# EAGLE design RFIDAccess (EAGLE 9.1.3)
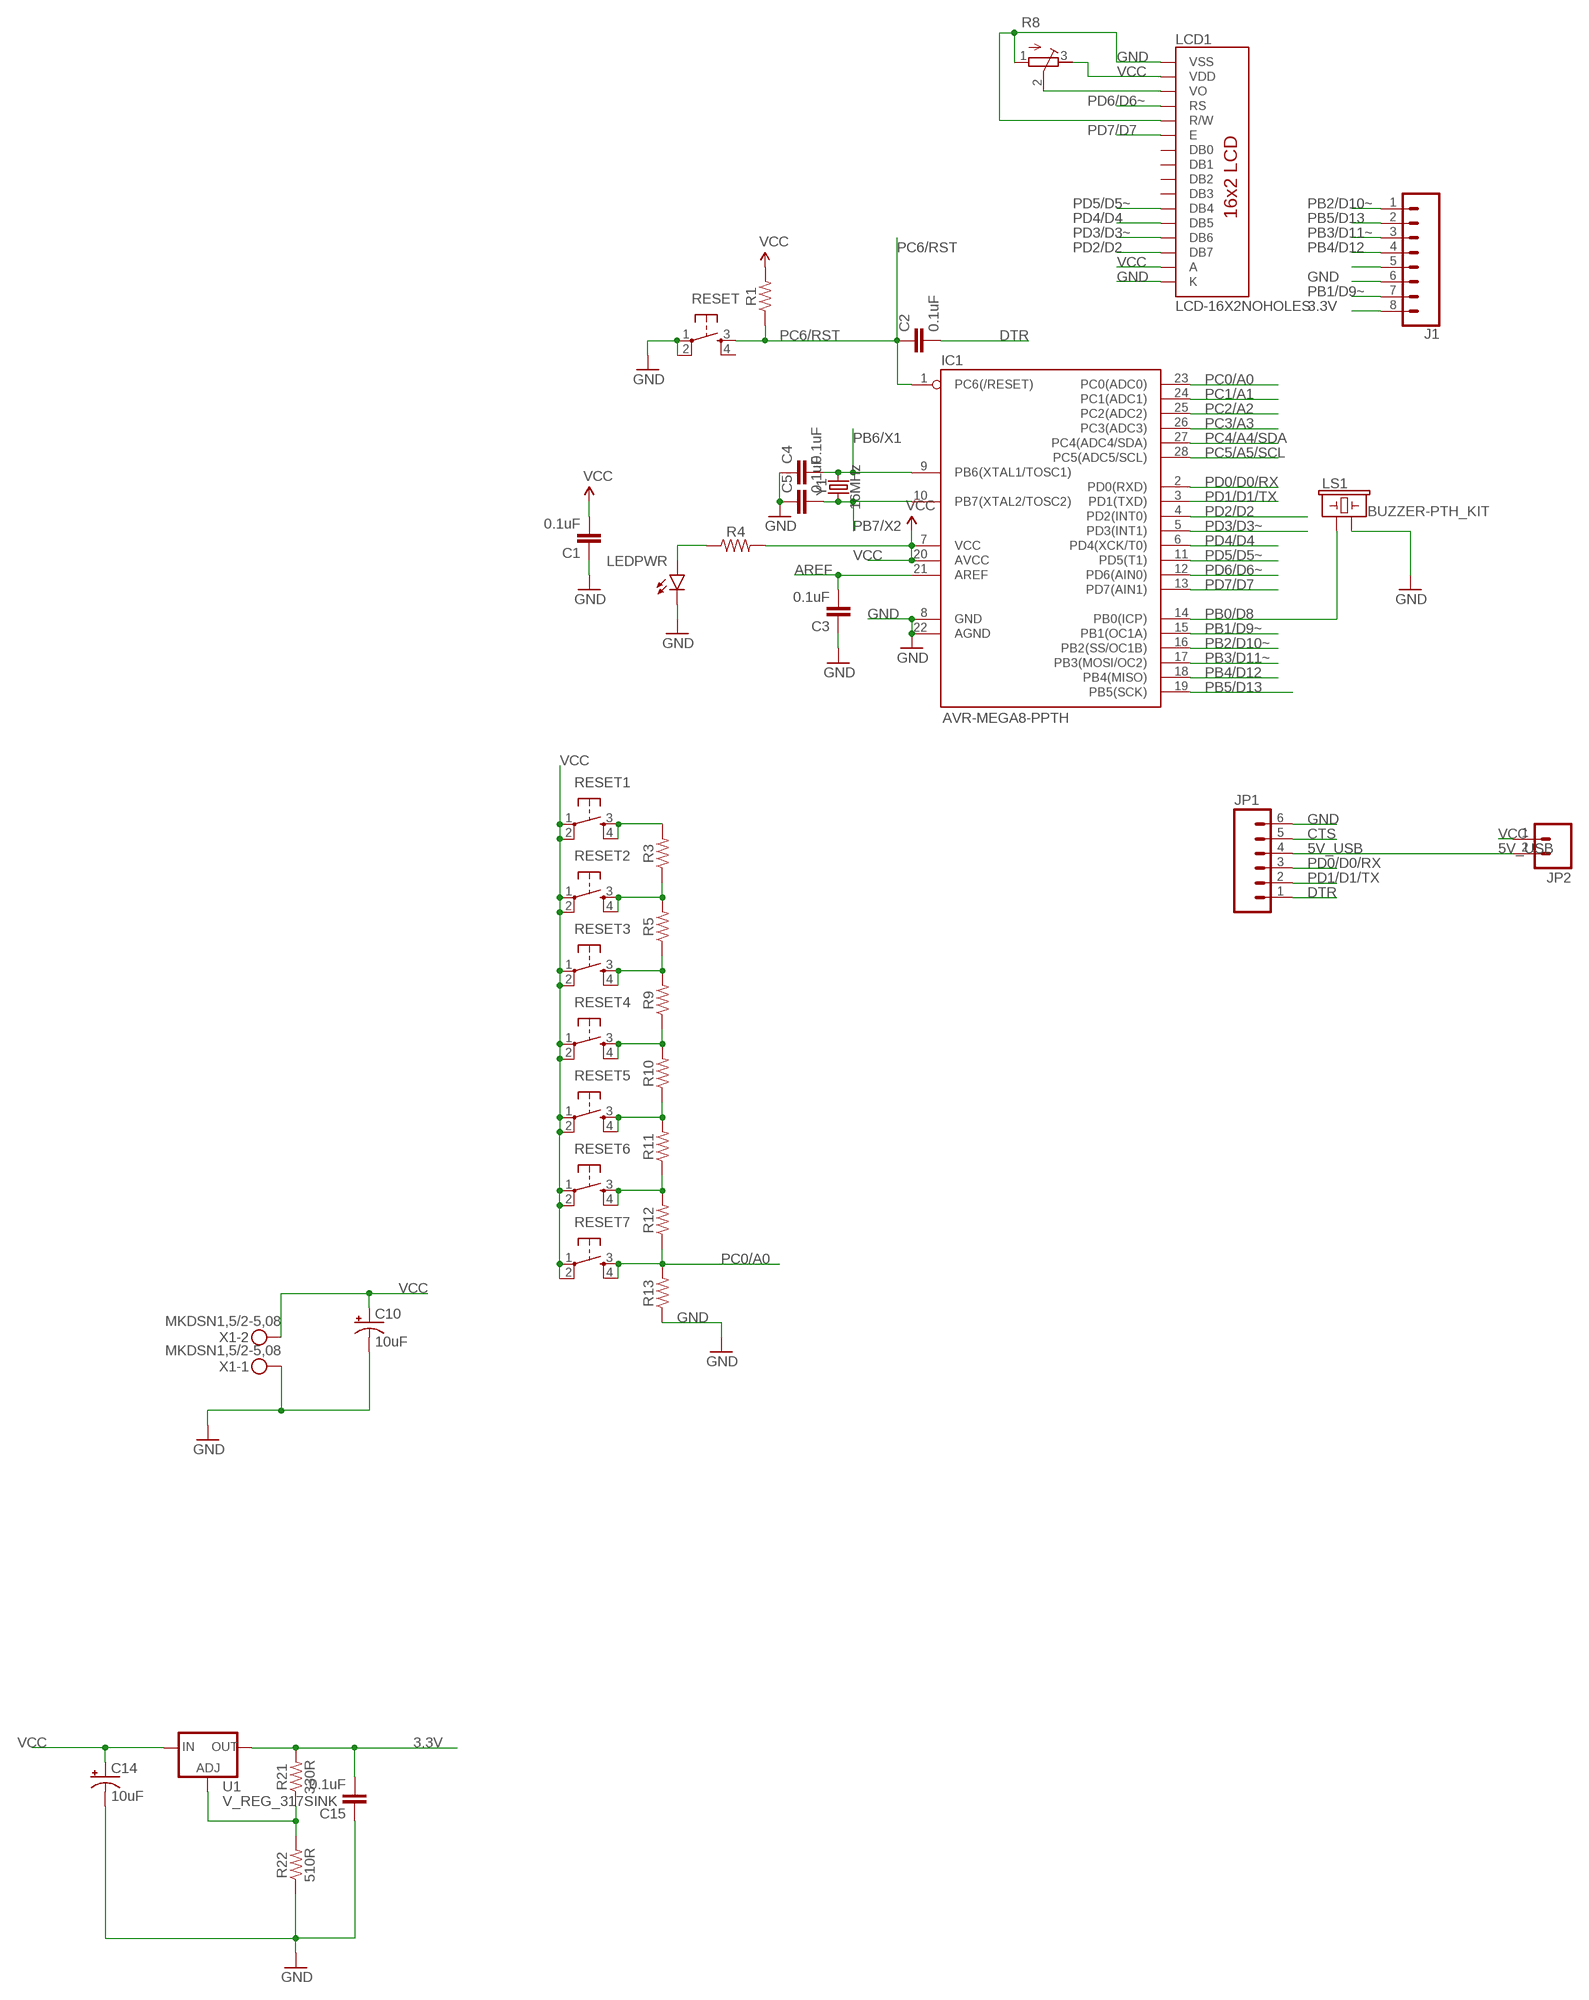
[diagram p0: schematic, sheet 1]

## Parts
C1  0.1uF  0.1UF-KIT-EZ-50V-20%  [CAP-PTH-SMALL-KIT]
C2  0.1uF  0.1UF-KIT-EZ-50V-20%  [CAP-PTH-SMALL-KIT]
C3  0.1uF  0.1UF-KIT-EZ-50V-20%  [CAP-PTH-SMALL-KIT]
C4  0.1uF  0.1UF-KIT-EZ-50V-20%  [CAP-PTH-SMALL-KIT]
C5  0.1uF  0.1UF-KIT-EZ-50V-20%  [CAP-PTH-SMALL-KIT]
C10  10uF  10UF-POLAR-RADIAL-2.5MM-KIT-25V-20%  [CPOL-RADIAL-2.5MM-5MM-KIT]
C14  10uF  10UF-POLAR-RADIAL-2.5MM-KIT-25V-20%  [CPOL-RADIAL-2.5MM-5MM-KIT]
C15  0.1uF  0.1UF-KIT-EZ-50V-20%  [CAP-PTH-SMALL-KIT]
IC1  AVR-MEGA8-PPTH  [DIL28-3]
J1  CONN_08LONGPADS  [1X08_LONGPADS]
JP1  M06SIP  [1X06]
JP2  M02PTH  [1X02]
LCD1  LCD-16X2NOHOLES  [LCD-16X2_NOHOLESNOSILK]
LEDPWR  LED5MM-KIT  [LED_5MM-KIT]
LS1  BUZZER-PTH_KIT  [BUZZER-12MM-KIT]
R1  RESISTORAXIAL-0.3-KIT  [AXIAL-0.3-KIT]
R3  RESISTORAXIAL-0.3-KIT  [AXIAL-0.3-KIT]
R4  RESISTORAXIAL-0.3-KIT  [AXIAL-0.3-KIT]
R5  RESISTORAXIAL-0.3-KIT  [AXIAL-0.3-KIT]
R8  R-TRIMM3296W  [RTRIM3296W]
R9  RESISTORAXIAL-0.3-KIT  [AXIAL-0.3-KIT]
R10  RESISTORAXIAL-0.3-KIT  [AXIAL-0.3-KIT]
R11  RESISTORAXIAL-0.3-KIT  [AXIAL-0.3-KIT]
R12  RESISTORAXIAL-0.3-KIT  [AXIAL-0.3-KIT]
R13  RESISTORAXIAL-0.3-KIT  [AXIAL-0.3-KIT]
R21  330R  RESISTORAXIAL-0.3-KIT  [AXIAL-0.3-KIT]
R22  510R  RESISTORAXIAL-0.3-KIT  [AXIAL-0.3-KIT]
RESET  TAC_SWITCHPTH  [TACTILE-PTH]
RESET1  TAC_SWITCHPTH  [TACTILE-PTH]
RESET2  TAC_SWITCHPTH  [TACTILE-PTH]
RESET3  TAC_SWITCHPTH  [TACTILE-PTH]
RESET4  TAC_SWITCHPTH  [TACTILE-PTH]
RESET5  TAC_SWITCHPTH  [TACTILE-PTH]
RESET6  TAC_SWITCHPTH  [TACTILE-PTH]
RESET7  TAC_SWITCHPTH  [TACTILE-PTH]
U1  V_REG_317SINK  [TO220-ADJ]
X1  MKDSN1,5/2-5,08  [MKDSN1,5/2-5,08]
Y1  16MHz  CRYSTAL-16MHZPTH-HC49US  [HC49US]

## Nets
3.3V: C15.2 J1.8 R21.P$2 U1.OUT
5V_USB: JP1.4 JP2.2
AREF: C3.2 IC1.21(AREF)
CTS: JP1.5
DTR: C2.2 JP1.1
GND: C1.1 C3.1 C4.1 C5.1 C10.2(-) C14.2(-) C15.1 IC1.8(GND) IC1.22(AGND) J1.6 JP1.6 LCD1.1(VSS) LCD1.5(R/W) LCD1.16(K) LEDPWR.K(C) LS1.- R8.1(A) R13.P$1 R22.P$1 RESET.1 RESET.2 X1.1
N$2: LEDPWR.A R4.P$1
N$4: R3.P$2 RESET1.3 RESET1.4
N$5: LCD1.3(VO) R8.2(S)
N$6: R3.P$1 R5.P$2 RESET2.3 RESET2.4
N$7: R5.P$1 R9.P$2 RESET3.3 RESET3.4
N$8: R9.P$1 R10.P$2 RESET4.3 RESET4.4
N$9: R10.P$1 R11.P$2 RESET5.3 RESET5.4
N$10: R11.P$1 R12.P$2 RESET6.3 RESET6.4
N$14: J1.5
N$19: R21.P$1 R22.P$2 U1.ADJ
PB0/D8: IC1.14(PB0(ICP)) LS1.+
PB1/D9~: IC1.15(PB1(OC1A)) J1.7
PB2/D10~: IC1.16(PB2(SS/OC1B)) J1.1
PB3/D11~: IC1.17(PB3(MOSI/OC2)) J1.3
PB4/D12: IC1.18(PB4(MISO)) J1.4
PB5/D13: IC1.19(PB5(SCK)) J1.2
PB6/X1: C4.2 IC1.9(PB6(XTAL1/TOSC1)) Y1.2
PB7/X2: C5.2 IC1.10(PB7(XTAL2/TOSC2)) Y1.1
PC0/A0: IC1.23(PC0(ADC0)) R12.P$1 R13.P$2 RESET7.3 RESET7.4
PC1/A1: IC1.24(PC1(ADC1))
PC2/A2: IC1.25(PC2(ADC2))
PC3/A3: IC1.26(PC3(ADC3))
PC4/A4/SDA: IC1.27(PC4(ADC4/SDA))
PC5/A5/SCL: IC1.28(PC5(ADC5/SCL))
PC6/RST: C2.1 IC1.1(PC6(/RESET)) R1.P$1 RESET.3
PD0/D0/RX: IC1.2(PD0(RXD)) JP1.3
PD1/D1/TX: IC1.3(PD1(TXD)) JP1.2
PD2/D2: IC1.4(PD2(INT0)) LCD1.14(DB7)
PD3/D3~: IC1.5(PD3(INT1)) LCD1.13(DB6)
PD4/D4: IC1.6(PD4(XCK/T0)) LCD1.12(DB5)
PD5/D5~: IC1.11(PD5(T1)) LCD1.11(DB4)
PD6/D6~: IC1.12(PD6(AIN0)) LCD1.4(RS)
PD7/D7: IC1.13(PD7(AIN1)) LCD1.6(E)
VCC: C1.2 C10.1(+) C14.1(+) IC1.7(VCC) IC1.20(AVCC) JP2.1 LCD1.2(VDD) LCD1.15(A) R1.P$2 R4.P$2 R8.3(E) RESET1.1 RESET1.2 RESET2.1 RESET2.2 RESET3.1 RESET3.2 RESET4.1 RESET4.2 RESET5.1 RESET5.2 RESET6.1 RESET6.2 RESET7.1 RESET7.2 U1.IN X1.2
Unconnected: LCD1.7(DB0) LCD1.8(DB1) LCD1.9(DB2) LCD1.10(DB3) RESET.4

## Library data of the parts
C1-C5 C15 = SparkFun-Capacitors:0.1UF: 0.1µF ceramic capacitors A capacitor is a passive two-terminal electrical component used to store electrical energy temporarily in an electric field.; PROD_ID: CAP-08370
C10 C14 = SparkFun-Capacitors:10UF-POLAR: 10.0µF polarized capacitors A capacitor is a passive two-terminal electrical component used to store electrical energy temporarily in an electric field.; PROD_ID: CAP-08440
IC1 = SparkFun-DigitalIC:AVR-MEGA8-P: MICROCONTROLLER 8 Kbytes FLASH 1 kbytes SRAM 512 bytes EEPROM USART 4-channel 10 bit ADC 2-channel 8 bit ADC
J1 = SparkFun-Connectors:CONN_08: Multi connection point. Often used as Generic Header-pin footprint for 0.1 inch spaced/style header connections On any of the 0.1 inch spaced packages, you can populate with these: Break Away Headers - Straight <https://www.sparkfun.com/products/116> (PRT-00116) Break Away Male Headers - Right Angle <https://www.sparkfun.com/products/553> (PRT-00553) Female Headers <https://www.sparkfun.com/products/115> (PRT-00115) Break Away Headers - Machine Pin <https://www.sparkfun.com/products/117> (PRT-00117) Break Away Female Headers - Swiss Machine Pin <https://www.sparkfun.com/products/743> (PRT-00743) Arduino Stackable Header - 8 Pin <https://www.sparkfun.com/products/9279> (PRT-09279) For SCREWTERMINALS and SPRING TERMINALS visit here: Screw Terimnals on SparkFun.com <https://www.sparkfun.com/search/results?term=Screw+Terminals> (5mm/3.5mm/2.54mm spacing) This device is also useful as a general connection point to wire up your design to another part of your project. Our various solder wires solder well into these plated through hole pads. Hook-Up Wire - Assortment (Stranded, 22 AWG) <https://www.sparkfun.com/products/11375> (PRT-11375) Hook-Up Wire - Assortment (Solid Core, 22 AWG) <https://www.sparkfun.com/products/11367> (PRT-11367) View the entire wire category on our website here <https://www.sparkfun.com/categories/141> Special notes: Molex polarized connector foot print use with SKU : PRT-08231 with associated crimp pins and housings. 1MM SMD Version SKU: PRT-10208 NOTES ON THE VARIANTS LOCK and LOCK_LONGPADS... This footprint was designed to help hold the alignment of a through-hole component (i.e. 6-pin header) while soldering it into place. You may notice that each hole has been shifted either up or down by 0.005 of an inch from it's more standard position (which is a perfectly straight line). This slight alteration caused the pins (the squares in the middle) to touch the edges of the holes. Because they are alternating, it causes a "brace" to hold the component in place. 0.005 has proven to be the perfect amount of "off-center" position when using our standard breakaway headers. Although looks a little odd when you look at the bare footprint, once you have a header in there, the alteration is very hard to notice. Also,if you push a header all the way into place, it is covered up entirely on the bottom side.
JP1 = SparkFun:M06: Header 6 Standard 6-pin 0.1" header. Use with straight break away headers (SKU : PRT-00116), right angle break away headers (PRT-00553), swiss pins (PRT-00743), machine pins (PRT-00117), and female headers (PRT-00115). Molex polarized connector foot print use with SKU : PRT-08094 with associated crimp pins and housings. NOTES ON THE VARIANTS LOCK and LOCK_LONGPADS... This footprint was designed to help hold the alignment of a through-hole component (i.e. 6-pin header) while soldering it into place. You may notice that each hole has been shifted either up or down by 0.005 of an inch from it's more standard position (which is a perfectly straight line). This slight alteration caused the pins (the squares in the middle) to touch the edges of the holes. Because they are alternating, it causes a "brace" to hold the component in place. 0.005 has proven to be the perfect amount of "off-center" position when using our standard breakaway headers. Although looks a little odd when you look at the bare footprint, once you have a header in there, the alteration is very hard to notice. Also, if you push a header all the way into place, it is covered up entirely on the bottom side. This idea of altering the position of holes to aid alignment will be further integrated into the Sparkfun Library for other footprints. It can help hold any component with 3 or more connection pins.
JP2 = SparkFun:M02: Header 2 Standard 2-pin 0.1" header. Use with straight break away headers (SKU : PRT-00116), right angle break away headers (PRT-00553), swiss pins (PRT-00743), machine pins (PRT-00117), and female headers (PRT-00115). Molex polarized connector foot print use with SKU : PRT-08233 with associated crimp pins and housings.
LCD1 = SparkFun-Displays:LCD-16X2: Standard text-only 16x2 parallel input LCD Basic 16 character by 2 line display. Typically utilizes the extremely common HD44780 parallel interface chipset SparkFun Products: Basic 16x2 Green <https://www.sparkfun.com/products/255> Basic 8x2 Green <https://www.sparkfun.com/products/11122>; SF_ID: LCD-00255
LEDPWR = SparkFun-LED:LED: LED (Generic) Standard schematic elements and footprints for 5mm, 3mm, 1206, and 0603 sized LEDs. Generic LEDs with no color specified.
LS1 = SparkFun-Electromechanical:BUZZER: Buzzer Small round buzzers that operate around the audible 2kHz range. You can use these as speakers to create simple music or user interfaces. Variant Overview: PTH - Mini Speaker - PC Mount 12mm 2.048kHz <https://www.sparkfun.com/products/7950> PTH_KIT - Mini Speaker - PC Mount 12mm 2.048kHz <https://www.sparkfun.com/products/7950> KIT simplifies soldering by adding stop mask to one side of the pads. PTH_NO_SILK - Mini Speaker - PC Mount 12mm 2.048kHz <https://www.sparkfun.com/products/7950> No silkscreen indicator of buzzer outline. PTH_KIT_NO_SILK - Mini Speaker - PC Mount 12mm 2.048kHz <https://www.sparkfun.com/products/7950> KIT package w/o silkscreen SMD - Buzzer Audio Magnetic (CCV-084B16) SMD buzzer used on, e.g. the LilyPad Buzzer <https://www.sparkfun.com/products/8463> and RFID USB Reader <https://www.sparkfun.com/products/9963>. SMD_KIT - Buzzer Audio Magnetic (CCV-084B16) SMD Buzzer with elongated pins to make soldering easier. Used on the SparkFun Simon Says - Surface Mount Soldering Kit <https://www.sparkfun.com/products/10935>.; PROD_ID: COMP-08253; SF_SKU: COM-07950
R1 R3-R5 R9-R13 R21 R22 = SparkFun-Resistors:RESISTOR: Generic Resistor Package
R8 = resistor:R-TRIMM: Trimm resistor
RESET RESET1-RESET7 = SparkFun-Electromechanical:TAC_SWITCH: Momentary Switch Button commonly used for reset or general input. Spark Fun Electronics SKU : COM-00097
U1 = SparkFun-IC-Power:V_REG_317: Voltage Regulator Standard LM317 adjustable voltage regulator. AOI (Adjust Output Input). Google 'LM317 Calculator' for easy to use app to get the two resistor values needed. 240/720 for 5V output. 240/390 for 3.3V output. Spark Fun Electronics SKU : COM-00527
X1 = con-phoenix-508:MKDSN1,5/2-5,08: MKDSN 1,5/ 2-5,08 Printklemme Nennstrom: 13,5 A Nennspannung: 250 V Rastermaß: 5,08 mm Polzahl: 2 Anschlussart: Schraubanschluss Montage: Löten Anschlussrichtung Leiter/Platine: 0 ° Artikelnummer: 1729128 Source: http://eshop.phoenixcontact.com .. 1729128.pdf
Y1 = SparkFun-Clocks:CRYSTAL-16MHZ: 16MHz Crystal Digikey Example <http://www.digikey.com/product-search/en?keywords=535-9122-1-ND> Frequency: 16MHz Frequency Stability: ±50ppm Frequency Tolerance: ±20ppm Load Capacitance: 18pF SparkFun Products: Pro Micro -5V/16MHz <https://www.sparkfun.com/products/12640> SparkFun Serial Enabled LCD Kit <https://www.sparkfun.com/products/10097>; PROD_ID: XTAL-08181; SF_ID: COM-00536

## Net classes
0 default: width 0.61 mm, drill 0.9 mm, clearance 0.203 mm

## Board
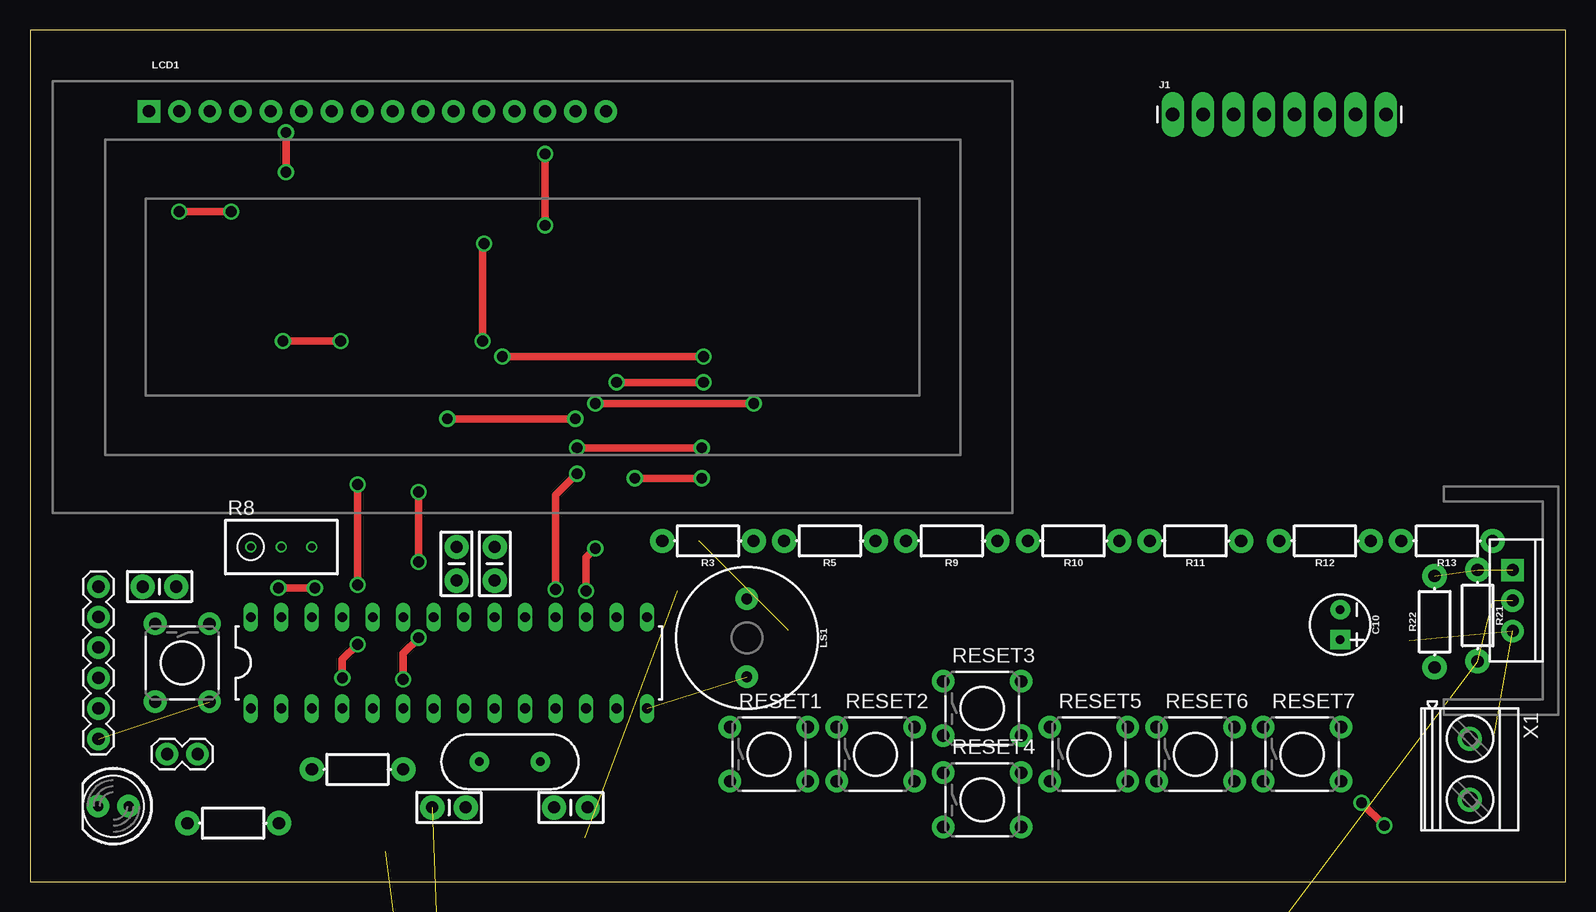
[diagram p1: board, top side]
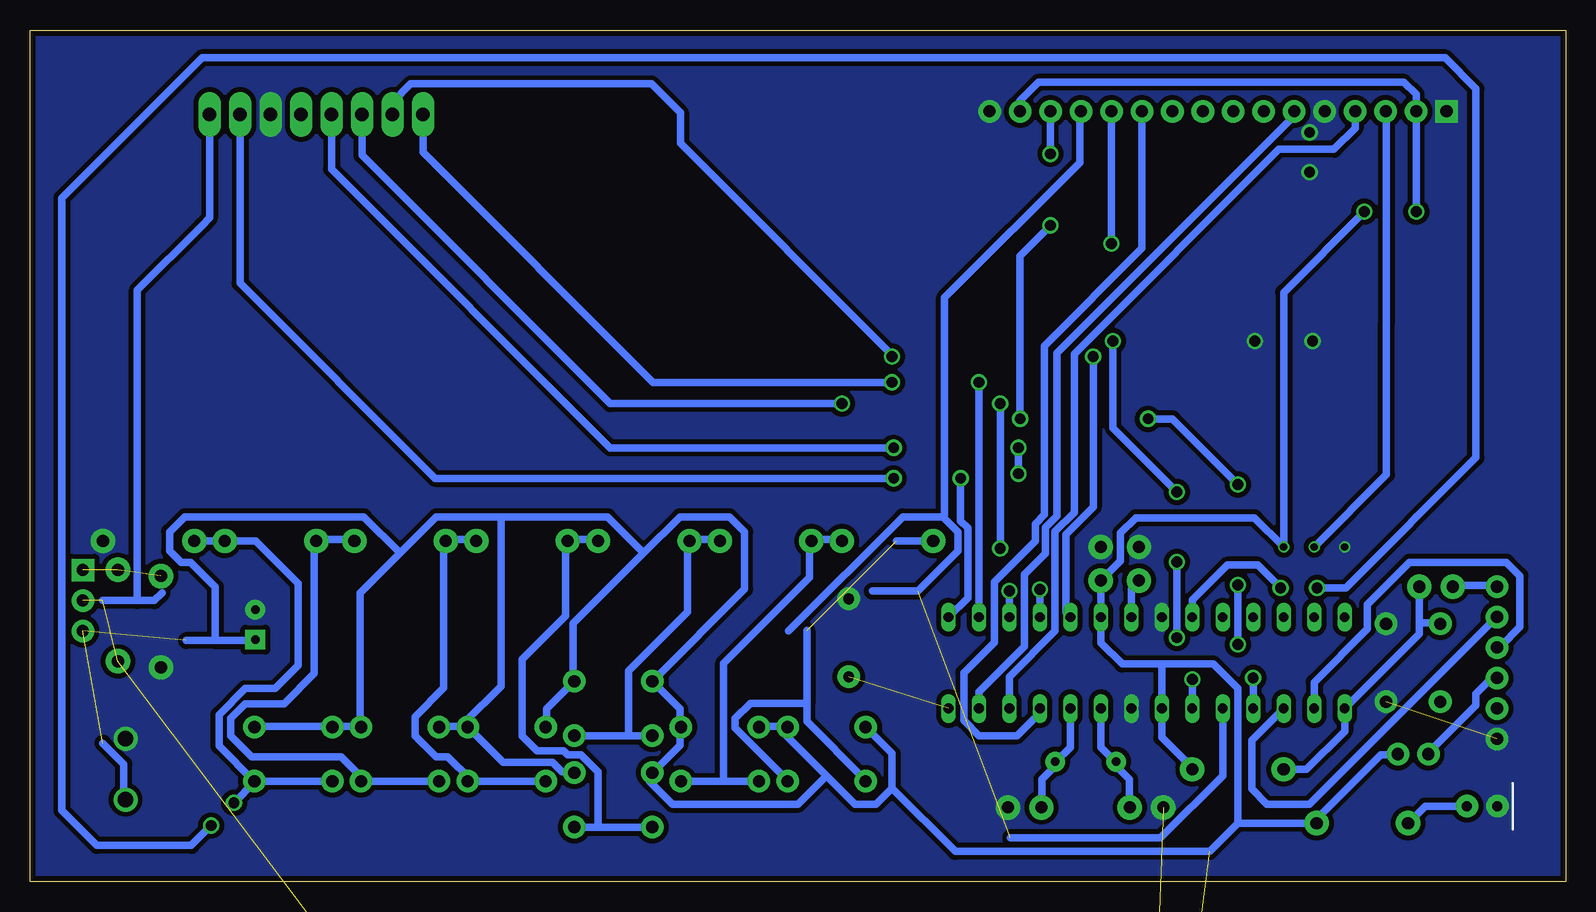
[diagram p2: board, bottom side, seen from below]

Size 128 x 71 mm. Coordinates in mm from the lower left corner, seen from the top.
Outline: 0,0 128,0 128,71 0,71 0,0
Copper layers (1*16): Top 0.017mm / dielectric 1.566mm / Bottom 0.017mm
Design rules "default": minimum track width 4mil, minimum drill 8mil, track to track 4mil, track to pad 4mil, pad to pad 4mil, via to via 4mil, smd to smd 4mil, copper to edge 18mil, drill to drill 9mil, minimum pad ring 5mil, minimum via ring 5mil, stop-mask expansion 2.5mil, vias tented up to drill 0mil, thermal gap 10mil

### Footprints (pad centres in the part's own frame; a part is rotated, then mirrored left to right if it is on the bottom)
CAP-PTH-SMALL-KIT = drill 1.016 pad 2.032: 1 -1.397,0; 2 1.397,0
CPOL-RADIAL-2.5MM-5MM-KIT = drill 0.7 pad 1.651 square: 1 1.25,0 | drill 0.7 pad 1.651: 2 -1.25,0
DIL28-3 = drill 0.813 long: 1 -16.51,-3.81; 2 -13.97,-3.81; 3 -11.43,-3.81; 4 -8.89,-3.81; 5 -6.35,-3.81; 6 -3.81,-3.81; 7 -1.27,-3.81; 8 1.27,-3.81; 9 3.81,-3.81; 10 6.35,-3.81; 11 8.89,-3.81; 12 11.43,-3.81; 13 13.97,-3.81; 14 16.51,-3.81; 15 16.51,3.81; 16 13.97,3.81; 17 11.43,3.81; 18 8.89,3.81; 19 6.35,3.81; 20 3.81,3.81; 21 1.27,3.81; 22 -1.27,3.81; 23 -3.81,3.81; 24 -6.35,3.81; 25 -8.89,3.81; 26 -11.43,3.81; 27 -13.97,3.81; 28 -16.51,3.81
1X08_LONGPADS = drill 1.118 pad 1.88 long: 1 0,0; 2 2.54,0; 3 5.08,0; 4 7.62,0; 5 10.16,0; 6 12.7,0; 7 15.24,0; 8 17.78,0
1X06 = drill 1.016 pad 1.88: 1 0,0; 2 2.54,0; 3 5.08,0; 4 7.62,0; 5 10.16,0; 6 12.7,0
1X02 = drill 1.016 pad 1.88: 1 0,0; 2 2.54,0
LCD-16X2_NOHOLESNOSILK = drill 1.016 pad 1.88 square: 1 -32,15.5 | drill 1.016 pad 1.88: 2 -29.46,15.5; 3 -26.92,15.5; 4 -24.38,15.5; 5 -21.84,15.5; 6 -19.3,15.5; 7 -16.76,15.5; 8 -14.22,15.5; 9 -11.68,15.5; 10 -9.14,15.5; 11 -6.6,15.5; 12 -4.06,15.5; 13 -1.52,15.5; 14 1.02,15.5; 15 3.56,15.5; 16 6.1,15.5
LED_5MM-KIT = drill 0.813 pad 1.88: A -1.27,0; K 1.27,0
BUZZER-12MM-KIT = drill 0.9 pad 1.88: + 3.25,0; - -3.25,0
AXIAL-0.3-KIT = drill 1.016 pad 2.032: P$1 -3.81,0; P$2 3.81,0
RTRIM3296W = drill 0.61: 1 0,-2.54; 2 0,0; 3 0,2.54
TACTILE-PTH = drill 1.016 pad 1.88: 1 -3.251,2.261; 2 3.251,2.261; 3 -3.251,-2.261; 4 3.251,-2.261
TO220-ADJ = drill 1 pad 1.88 square: ADJ -2.54,0 | drill 1 pad 1.88: IN 2.54,0; OUT 0,0
MKDSN1,5/2-5,08 = drill 1.3 pad 2: 1 -2.561,0.025; 2 2.519,0.025
HC49US = drill 0.7 pad 1.651: 1 -2.54,0; 2 2.54,0

### Placement (x,y rotation side)
C1  38.74,26.5 270 top
C2  10.79,24.59 180 top
C3  35.56,26.5 270 top
C4  34.93,6.17 0 top
C5  45.09,6.17 180 top
C10  109.22,21.41 270 top
C14  37.66,-68.99 0 top  (outside the outline)
C15  40.99,-85.57 0 top  (outside the outline)
IC1  34.93,18.24 0 top
J1  95.25,63.96 0 top
JP1  5.71,24.59 270 top
JP2  13.97,10.62 180 top
LCD1  41.91,48.72 0 top
LEDPWR  6.95,6.28 180 top
LS1  59.76,20.32 270 top
R1  27.3,9.35 0 top
R3  56.52,28.4 180 top
R4  16.93,4.86 0 top
R5  66.67,28.4 180 top
R8  20.95,27.89 270 top
R9  76.84,28.4 180 top
R10  87,28.4 180 top
R11  97.16,28.4 180 top
R12  107.95,28.4 180 top
R13  118.11,28.4 180 top
R21  120.67,22.18 270 top
R22  117.09,21.66 90 top
RESET  12.7,18.24 270 top
RESET1  61.6,10.62 0 top
RESET2  70.48,10.62 0 top
RESET3  79.38,14.43 0 top
RESET4  79.38,6.81 0 top
RESET5  88.27,10.62 0 top
RESET6  97.16,10.62 0 top
RESET7  106.05,10.62 0 top
U1  123.58,23.42 270 top
X1  120.02,9.35 270 top
Y1  40.01,9.98 180 top

### Tracks (layer width: path | path; a pad name or v marks a point on that pad's centre or on a via)
3.3V  (3 unrouted)
  Bottom 0.61: 119.06,23.43 117.63,23.43 117,24.07 | 119.06,23.43 121.92,23.43 | 119.06,23.43 119.06,49.31 113.67,54.7 113.03,55.34 J1.8
5V_USB
  Bottom 0.61: JP2.2 11.43,10.73 7.46,14.7 7.46,15.65 6.19,16.92 5.71,16.92 JP1.4
AREF
  Bottom 0.61: IC1.21 36.2,22.16 36.2,24.38 35.56,25.02 C3.2
DTR
  Bottom 0.61: JP1.1 5.71,24.7 9.37,24.7 C2.2
GND  (via drill 0.9)  (3 unrouted)
  Top 0.61: v21.34,62.45 v21.34,59.15 | v21.08,45.05 v25.91,45.05
  pour Bottom (isolate 0.406, no thermals): 0,0 128,0 128,71 0,71
N$2
  Bottom 0.61: LEDPWR.A 11.71,6.28 R4.P$1
N$4  (1 unrouted)
  Bottom 0.61: RESET1.3 58.42,8.51 63.25,13.34 63.25,14.86 | 63.25,14.86 67.95,14.86 69.22,13.59 69.22,12.79 64.93,8.51 RESET1.4 | R3.P$2 55.77,28.4 | 63.25,20.92 63.25,14.86
N$5
  Bottom 0.61: LCD1.3 14.92,64.07 14.92,46.58 14.92,33.92 R8.2
N$6
  Bottom 0.61: R3.P$1 60.33,28.51 62.87,28.51 R5.P$2 63.02,28.19 63.02,25.34 70.17,18.19 70.17,8.51 70.17,8.35 | 70.17,8.35 73.66,8.35 RESET2.4 | 70.17,8.35 67.31,8.35 RESET2.3
N$7
  Bottom 0.61: R5.P$1 70.48,28.51 73.03,28.51 R9.P$2 73.18,28.19 73.18,22.48 78.11,17.56 78.11,12.32 78.11,12.16 | 78.11,12.16 82.55,12.16 RESET3.4 | 78.11,12.16 76.2,12.16 RESET3.3
N$8
  Bottom 0.61: R9.P$1 80.65,28.51 83.19,28.51 R10.P$2 83.34,28.19 83.34,22.16 87,18.51 87,12.16 85.73,10.89 83.5,10.89 83.19,10.57 82.07,10.57 80.65,9.14 80.65,4.7 80.65,4.54 | 80.65,4.54 82.55,4.54 RESET4.4 | 80.65,4.54 76.2,4.54 RESET4.3
N$9
  Bottom 0.61: R10.P$1 90.81,28.51 93.34,28.51 R11.P$2 93.5,28.19 93.5,16.13 95.89,13.75 95.89,12.16 94.14,10.41 93.19,10.41 91.28,8.51 RESET5.4 91.44,8.35 85.09,8.35 RESET5.3
N$10
  Bottom 0.61: R11.P$1 100.97,28.51 104.14,28.51 R12.P$2 104.3,28.19 104.3,17.34 106.81,14.83 110.05,14.83 111.28,13.59 111.28,12.16 109.54,10.41 102.08,10.41 100.17,8.51 RESET6.4 100.33,8.35 93.98,8.35 RESET6.3
N$19  (2 unrouted)
PB0/D8  (1 unrouted)
PB1/D9~  (via drill 0.9)
  Top 0.61: v56.01,33.62 v50.42,33.62
  Bottom 0.61: J1.7 110.49,49.88 94.23,33.62 v56.01,33.62 | v50.42,33.62 50.42,30.07 49.83,29.48 49.83,23.66 IC1.15
PB2/D10~  (via drill 0.9)
  Top 0.61: v48.9,41.62 v56.13,41.62
  Bottom 0.61: IC1.16 v48.9,41.62 | v56.13,41.62 76.07,41.62 95.25,60.8 J1.1
PB3/D11~  (via drill 0.9)
  Top 0.61: v47.12,39.85 v60.33,39.85 | v46.36,24.23 46.36,27.02 v47.12,27.78
  Bottom 0.61: IC1.17 v46.36,24.23 | v47.12,27.78 v47.12,39.85 | v60.33,39.85 79.63,39.85 100.33,60.55 J1.3
PB4/D12  (via drill 0.9)
  Top 0.61: v43.82,24.35 43.82,32.23 v45.59,34 | v56.01,36.16 v45.59,36.16
  Bottom 0.61: IC1.18 v43.82,24.35 | v45.59,34 v45.59,36.16 | J1.4 102.87,59.4 79.63,36.16 v56.01,36.16
PB5/D13  (via drill 0.9)
  Top 0.61: v56.13,43.78 v39.37,43.78
  Bottom 0.61: v56.13,43.78 56.01,43.78 73.79,61.56 73.79,64.1 76.2,66.52 96.27,66.52 97.79,64.99 J1.2 | v39.37,43.78 39.37,31.21 41.66,28.92 41.66,22.43 IC1.19
PB6/X1
  Bottom 0.61: IC1.9 38.74,14.38 38.74,11.21 37.47,9.94 Y1.2 37.62,9.78 36.35,8.51 36.35,6.29 C4.2
PB7/X2
  Bottom 0.61: IC1.10 41.28,14.38 41.28,11.21 42.55,9.94 Y1.1 42.39,9.78 43.66,8.51 43.66,6.29 C5.2
PC0/A0  (via drill 0.9)
  Top 0.61: v23.75,24.48 v20.7,24.48 | v112.9,4.67 v111,6.57
  Bottom 0.61: IC1.23 31.11,23.46 28.19,26.38 25.65,26.38 v23.75,24.48 | v20.7,24.48 18.32,24.48 7.46,35.34 7.46,66.1 10.03,68.67 113.67,68.67 125.35,56.99 125.35,5.94 122.43,3.02 114.55,3.02 v112.9,4.67 | RESET7.3 RESET7.4 | RESET7.4 112.24,11.3 112.24,13.91 110.05,16.1 107.57,16.1 105.66,18 105.66,24.86 109.2,28.4 R12.P$1 R13.P$2 | v111,6.57 109.3,8.27 RESET7.4
PC6/RST
  Bottom 0.61: 12.19,21.56 12.19,20.65 IC1.1 18.41,12.54 21.61,9.35 R1.P$1 | RESET.3 10.51,21.56 12.19,21.56 | C2.1 12.19,21.56
PD0/D0/RX
  Bottom 0.61: IC1.2 20.95,14.54 20.95,16.61 16.51,21.05 16.51,23.11 13.02,26.61 4.92,26.61 3.81,25.5 3.81,21.21 5.4,19.62 5.71,19.62 JP1.3
PD1/D1/TX
  Bottom 0.61: IC1.3 26.16,11.76 26.16,7.71 24.89,6.45 21.34,6.45 5.73,22.05 JP1.2
PD2/D2  (via drill 0.9)
  Top 0.61: v26.04,16.99 26.04,18.51 v27.3,19.78 | v27.3,24.73 v27.3,33.12 | v42.93,54.7 v42.93,60.67 | v34.8,38.58 v45.47,38.58
  Bottom 0.61: IC1.4 v26.04,16.99 | v27.3,19.78 v27.3,24.73 | v27.3,33.12 32.77,38.58 v34.8,38.58 | v45.47,38.58 45.47,52.16 v42.93,54.7 | v42.93,60.67 LCD1.14
PD3/D3~  (1 unrouted)
  Bottom 0.61: IC1.5 28.57,8.83 33.75,3.65 46.26,3.65 | 51.91,30.42 50.64,29.15 50.64,27.56 53.98,24.23 57.79,24.23 | 51.91,30.42 55.25,30.42 64.77,20.89 | LCD1.13 40.48,64.07 40.48,59.94 51.75,48.67 51.75,30.57 51.91,30.42
PD4/D4  (via drill 0.9)
  Top 0.61: v31.11,16.86 31.11,19.02 32.39,20.29 v32.39,20.33 | v32.39,26.64 v32.39,32.48 | v37.72,45.05 37.72,53.05 v37.85,53.18
  Bottom 0.61: IC1.6 v31.11,16.86 | v32.39,20.33 v32.39,26.64 | v32.39,32.48 37.72,37.81 v37.72,45.05 | LCD1.12 v37.85,53.19 v37.85,53.18
PD5/D5~
  Bottom 0.61: IC1.11 43.82,14.38 43.82,14.06 45.72,12.16 48.9,12.16 50.17,13.43 50.17,17.4 47.62,19.94 47.62,24.99 44.2,28.42 44.2,29.83 43.44,30.59 43.44,44.66 35.31,52.8 LCD1.11
PD6/D6~
  Bottom 0.61: IC1.12 46.36,14.54 46.36,17.08 42.55,20.89 42.55,29.18 40.96,30.77 40.96,43.97 23.88,61.05 19.3,61.05 17.53,62.83 LCD1.4
PD7/D7
  Bottom 0.61: IC1.13 48.9,15.81 45.09,19.62 45.09,25.62 43.36,27.35 43.36,29.52 42.39,30.49 42.39,44.07 22.7,63.75 22.7,64.07 LCD1.6
VCC  (via drill 0.9)  (3 unrouted)
  Top 0.61: v16.76,55.85 v12.45,55.85
  Bottom 0.61: R1.P$2 31.11,9.46 33.66,12 IC1.7 33.66,18.13 | JP2.1 13.97,10.57 15.4,10.57 20.75,5.23 R4.P$2 27.3,4.86 | 112.55,20.1 109.22,20.1 C10.1 | X1.2 120.17,6.92 120.17,9.78 121.92,11.53 | RESET4.2 82.71,9.14 83.66,9.14 84.45,9.94 88.58,9.94 91.44,12.79 RESET5.2 | RESET6.1 93.82,12.95 91.76,12.95 RESET5.2 | 61.6,8.83 64.93,12.16 64.93,12.79 RESET1.2 65.09,12.95 67.15,12.95 RESET2.1 | 61.6,8.83 59.21,6.45 57.47,6.45 56.13,7.78 | RESET7.2 109.22,12.95 103.03,12.95 RESET7.1 102.71,12.95 100.49,12.95 RESET6.2 100.49,13.11 100.49,24.07 97.16,27.4 | RESET5.1 84.93,12.95 84.93,14.38 82.71,16.61 RESET3.2 82.71,16.92 82.71,21.53 76.84,27.4 | 76.84,27.4 73.82,30.42 69.69,30.42 68.42,29.15 68.42,24.38 76.04,16.76 RESET3.1 76.04,16.61 73.82,14.38 73.82,13.11 RESET2.2 73.82,12.79 73.82,11.37 76.04,9.14 RESET4.1 76.36,8.98 76.36,8.35 74.45,6.45 63.98,6.45 61.6,8.83 | 97.16,27.4 94.14,30.42 88.74,30.42 | 88.74,30.42 79.85,30.42 76.84,27.4 | 88.74,30.42 88.74,16.29 91.76,13.27 RESET5.2 | 112.55,20.1 112.55,24.54 114.62,26.61 115.41,26.61 116.36,27.56 116.36,29.15 115.09,30.42 100.17,30.42 97.16,27.4 | LCD1.15 45.47,65.11 43.94,66.64 13.46,66.64 12.45,65.63 LCD1.2 v12.45,55.85 | v16.76,55.85 23.5,49.12 R8.3 25.92,30.32 35.81,30.32 37.08,29.05 37.08,26.75 C1.2 IC1.20 38.74,19.91 36.96,18.13 33.66,18.13 | RESET1.1 56.13,10.67 56.13,7.78 | 27.3,4.86 27.3,16.1 29.34,18.13 33.66,18.13 | 27.3,4.86 29.66,2.51 50.86,2.51 56.13,7.78 | 112.55,20.1 114.96,20.1